# EAGLE schematic standalone (EAGLE 9.3.0)

## Sheet 1 of 2
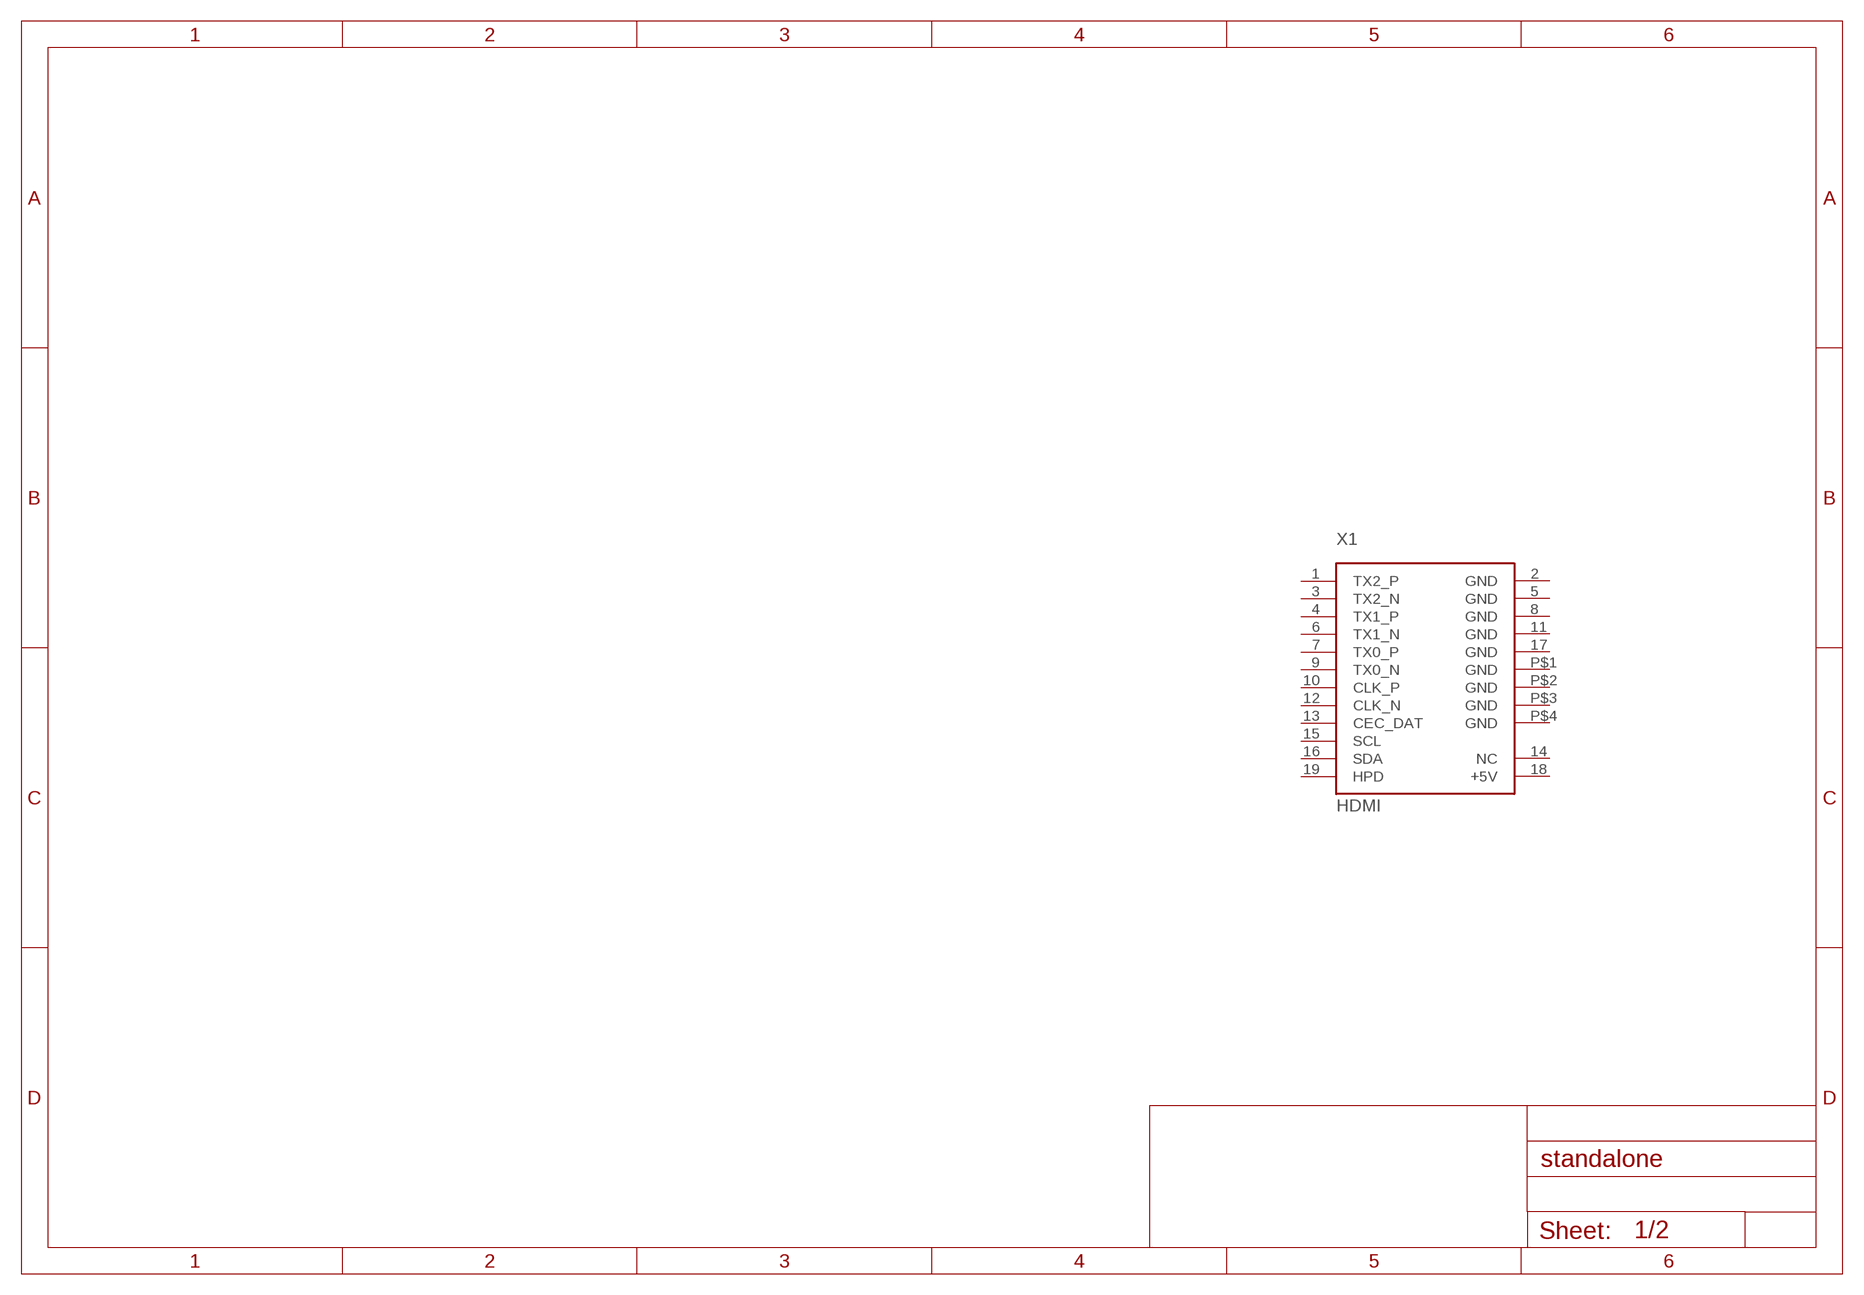
[diagram p0: schematic, sheet 1]

### Parts
X1  HDMI  [HDMI]
Unconnected: X1.1(TX2_P) X1.2(GND) X1.3(TX2_N) X1.4(TX1_P) X1.5(GND) X1.6(TX1_N) X1.7(TX0_P) X1.8(GND) X1.9(TX0_N) X1.10(CLK_P) X1.11(GND) X1.12(CLK_N) X1.13(CEC_DAT) X1.14(NC) X1.15(SCL) X1.16(SDA) X1.17(GND) X1.18(+5V) X1.19(HPD) X1.P$1(GND) X1.P$2(GND) X1.P$3(GND) X1.P$4(GND)

## Sheet 2 of 2
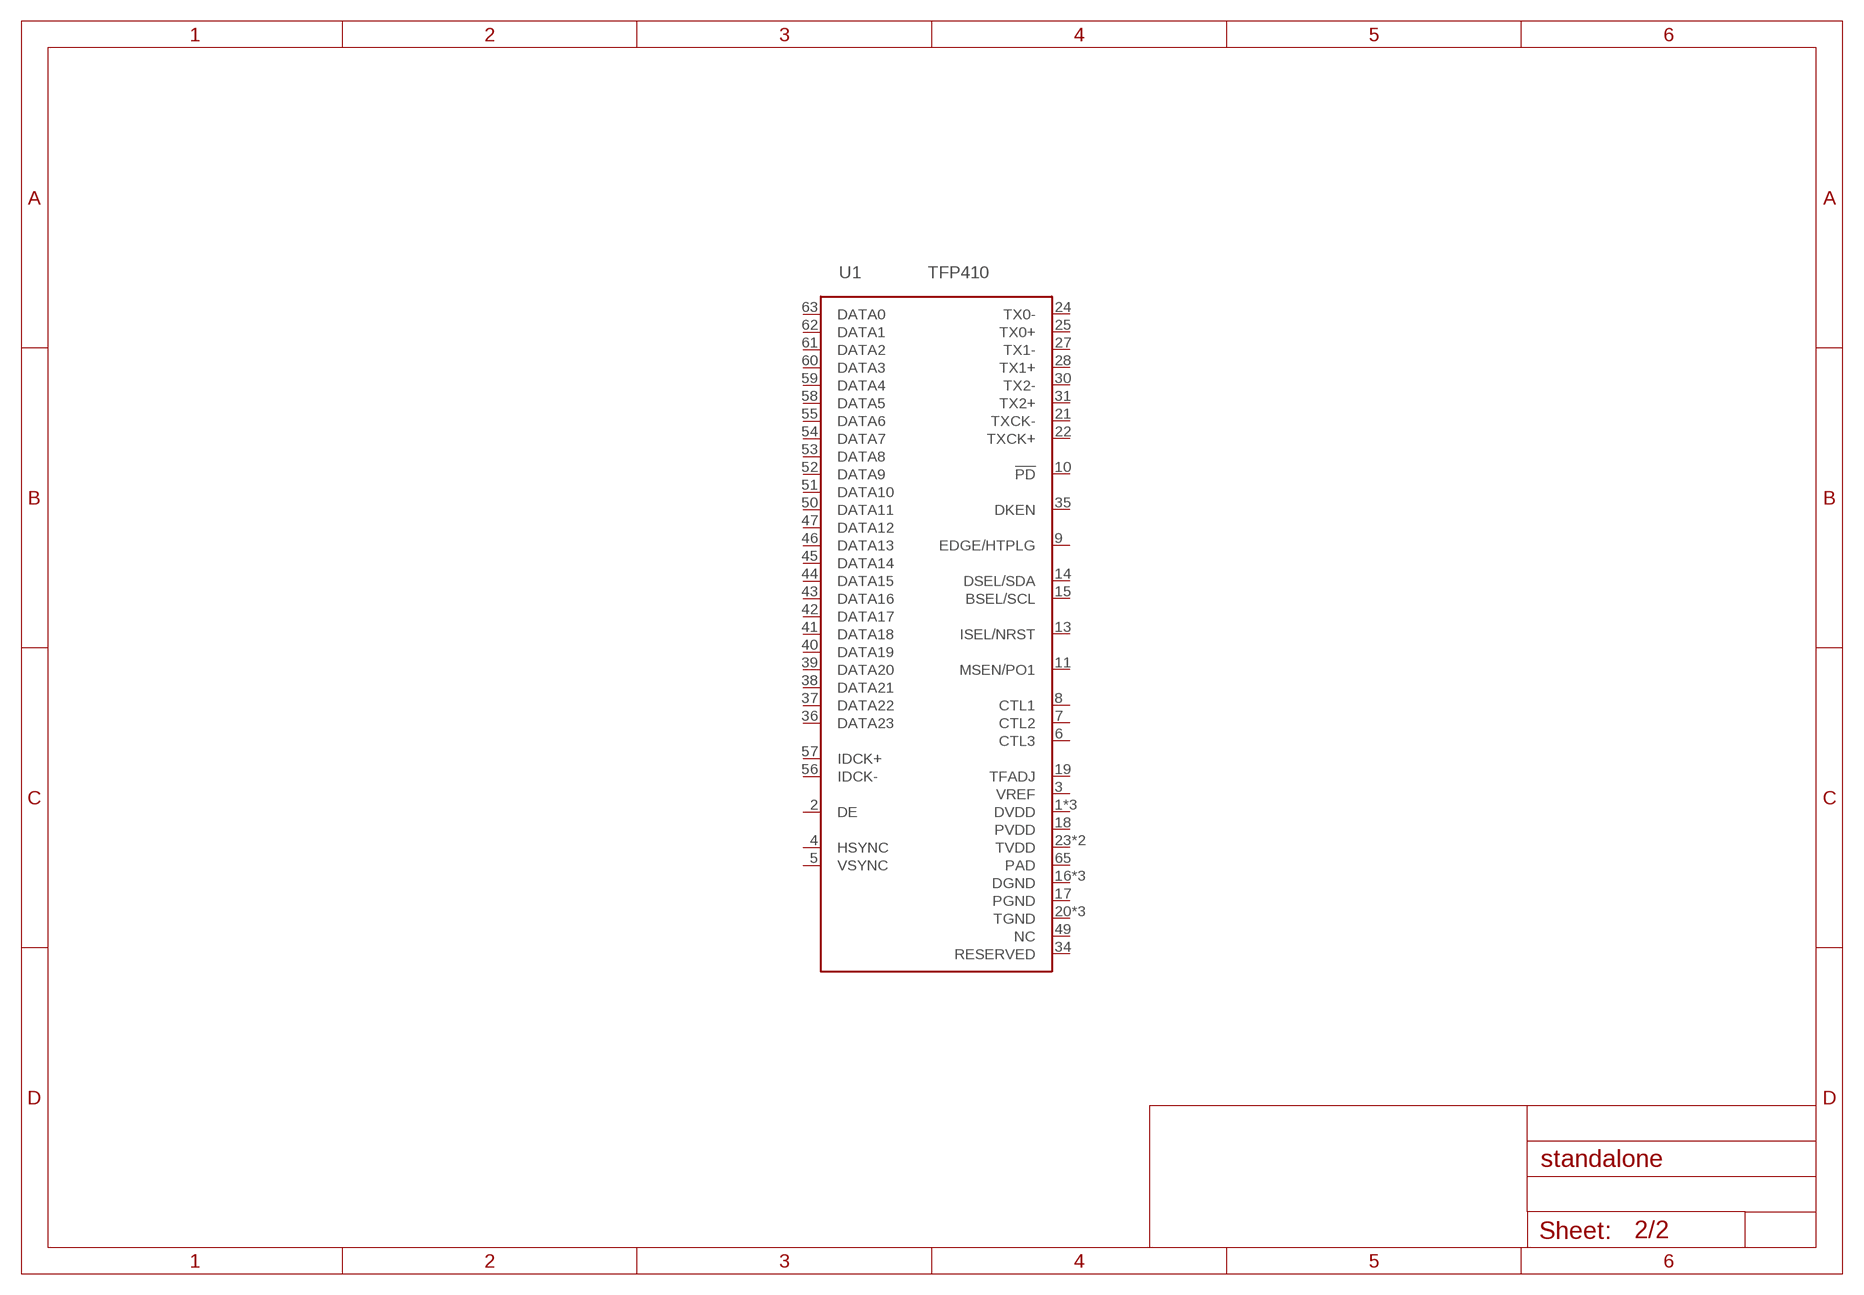
[diagram p1: schematic, sheet 2]

### Parts
U1  TFP410  [QFP50P1200X1200X120-65T500]
Unconnected: U1.1(DVDD) U1.2(DE) U1.3(VREF) U1.4(HSYNC) U1.5(VSYNC) U1.6(CTL3) U1.7(CTL2) U1.8(CTL1) U1.9(EDGE/HTPLG) U1.10(!PD) U1.11(MSEN/PO1) U1.12(DVDD) U1.13(ISEL/NRST) U1.14(DSEL/SDA) U1.15(BSEL/SCL) U1.16(DGND) U1.17(PGND) U1.18(PVDD) U1.19(TFADJ) U1.20(TGND) U1.21(TXCK-) U1.22(TXCK+) U1.23(TVDD) U1.24(TX0-) U1.25(TX0+) U1.26(TGND) U1.27(TX1-) U1.28(TX1+) U1.29(TVDD) U1.30(TX2-) U1.31(TX2+) U1.32(TGND) U1.33(DVDD) U1.34(RESERVED) U1.35(DKEN) U1.36(DATA23) U1.37(DATA22) U1.38(DATA21) U1.39(DATA20) U1.40(DATA19) U1.41(DATA18) U1.42(DATA17) U1.43(DATA16) U1.44(DATA15) U1.45(DATA14) U1.46(DATA13) U1.47(DATA12) U1.48(DGND) U1.49(NC) U1.50(DATA11) U1.51(DATA10) U1.52(DATA9) U1.53(DATA8) U1.54(DATA7) U1.55(DATA6) U1.56(IDCK-) U1.57(IDCK+) U1.58(DATA5) U1.59(DATA4) U1.60(DATA3) U1.61(DATA2) U1.62(DATA1) U1.63(DATA0) U1.64(DGND) U1.65(PAD)

## Library data of the parts
U1 = parts-ti:TFP410
X1 = parts-attend:HDMI